# Altium schematic sheet Decoupling_caps.SchDoc
size 246 x 182 mm
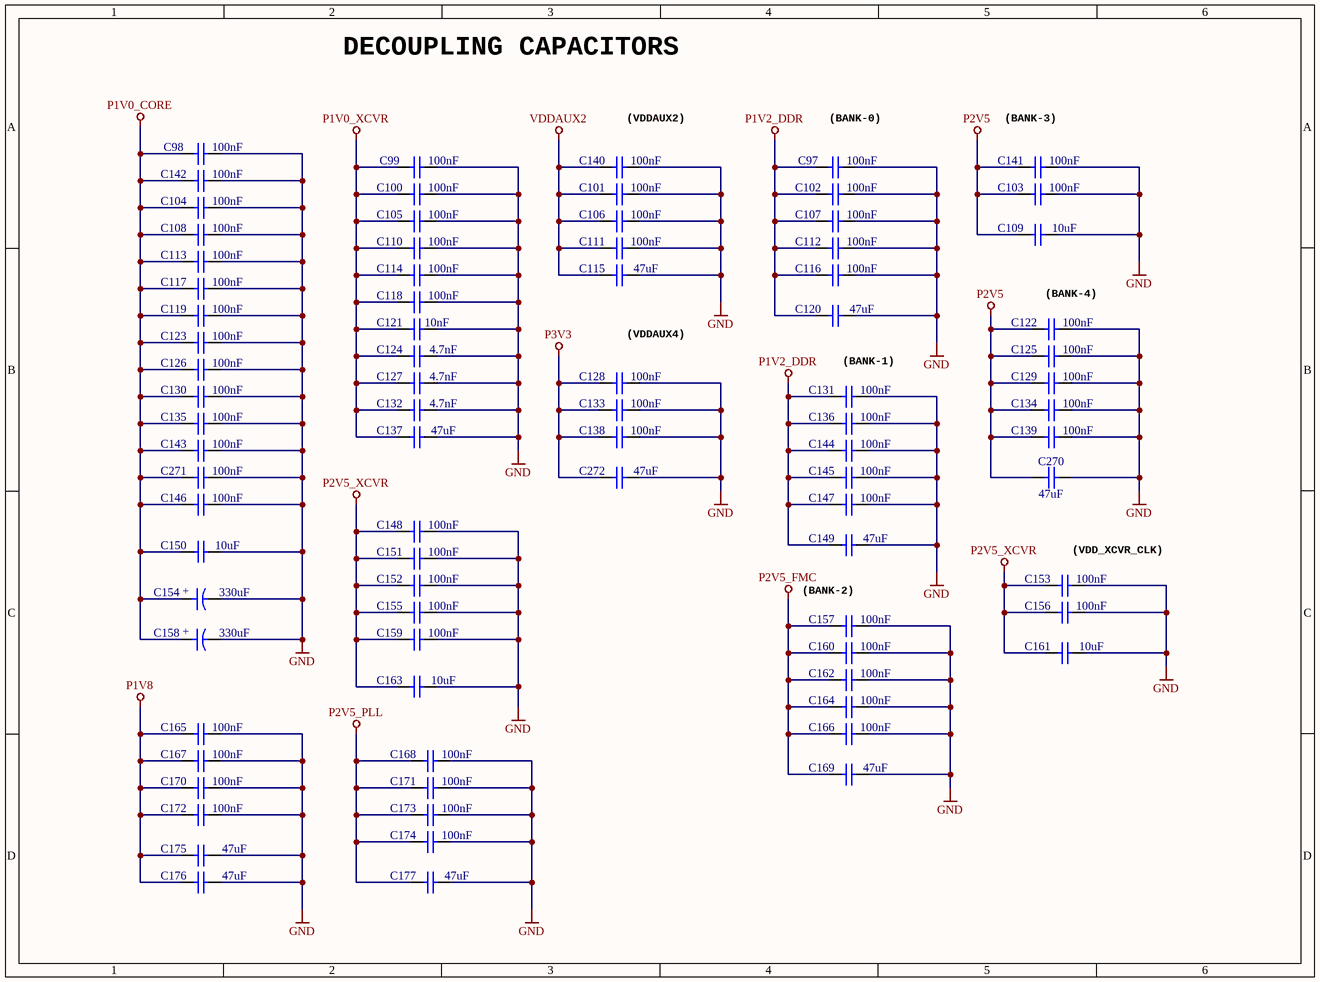
[diagram p0: Decoupling_caps.SchDoc]

## Parts
C97  100nF  [CAPC0603X33N]
C98  100nF  [CAPC0603X33N]
C99  100nF  [CAPC0603X33N]
C100  100nF  [CAPC0603X33N]
C101  100nF  [CAPC0603X33N]
C102  100nF  [CAPC0603X33N]
C103  100nF  [CAPC0603X33N]
C104  100nF  [CAPC0603X33N]
C105  100nF  [CAPC0603X33N]
C106  100nF  [CAPC0603X33N]
C107  100nF  [CAPC0603X33N]
C108  100nF  [CAPC0603X33N]
C109  10uF  [CAPC1608X80N]
C110  100nF  [CAPC0603X33N]
C111  100nF  [CAPC0603X33N]
C112  100nF  [CAPC0603X33N]
C113  100nF  [CAPC0603X33N]
C114  100nF  [CAPC0603X33N]
C115  47uF  [CAPC2012X140N]
C116  100nF  [CAPC0603X33N]
C117  100nF  [CAPC0603X33N]
C118  100nF  [CAPC0603X33N]
C119  100nF  [CAPC0603X33N]
C120  47uF  [CAPC2012X140N]
C121  10nF  [CAPC0603X33N]
C122  100nF  [CAPC0603X33N]
C123  100nF  [CAPC0603X33N]
C124  4.7nF  [CAPC0603X33N]
C125  100nF  [CAPC0603X33N]
C126  100nF  [CAPC0603X33N]
C127  4.7nF  [CAPC0603X33N]
C128  100nF  [CAPC0603X33N]
C129  100nF  [CAPC0603X33N]
C130  100nF  [CAPC0603X33N]
C131  100nF  [CAPC0603X33N]
C132  4.7nF  [CAPC0603X33N]
C133  100nF  [CAPC0603X33N]
C134  100nF  [CAPC0603X33N]
C135  100nF  [CAPC0603X33N]
C136  100nF  [CAPC0603X33N]
C137  47uF  [CAPC2012X140N]
C138  100nF  [CAPC0603X33N]
C139  100nF  [CAPC0603X33N]
C140  100nF  [CAPC0603X33N]
C141  100nF  [CAPC0603X33N]
C142  100nF  [CAPC0603X33N]
C143  100nF  [CAPC0603X33N]
C144  100nF  [CAPC0603X33N]
C145  100nF  [CAPC0603X33N]
C146  100nF  [CAPC0603X33N]
C147  100nF  [CAPC0603X33N]
C148  100nF  [CAPC0603X33N]
C149  47uF  [CAPC2012X140N]
C150  10uF  [CAPC1608X80N]
C151  100nF  [CAPC0603X33N]
C152  100nF  [CAPC0603X33N]
C153  100nF  [CAPC0603X33N]
C154  330uF  [CAPMP7343X310N]
C155  100nF  [CAPC0603X33N]
C156  100nF  [CAPC0603X33N]
C157  100nF  [CAPC0603X33N]
C158  330uF  [CAPMP7343X310N]
C159  100nF  [CAPC0603X33N]
C160  100nF  [CAPC0603X33N]
C161  10uF  [CAPC1608X80N]
C162  100nF  [CAPC0603X33N]
C163  10uF  [CAPC1608X80N]
C164  100nF  [CAPC0603X33N]
C165  100nF  [CAPC0603X33N]
C166  100nF  [CAPC0603X33N]
C167  100nF  [CAPC0603X33N]
C168  100nF  [CAPC0603X33N]
C169  47uF  [CAPC2012X140N]
C170  100nF  [CAPC0603X33N]
C171  100nF  [CAPC0603X33N]
C172  100nF  [CAPC0603X33N]
C173  100nF  [CAPC0603X33N]
C174  100nF  [CAPC0603X33N]
C175  47uF  [CAPC2012X140N]
C176  47uF  [CAPC2012X140N]
C177  47uF  [CAPC2012X140N]
C270  47uF  [CAPC2012X140N]
C271  100nF  [CAPC0603X33N]
C272  47uF  [CAPC2012X140N]

## Nets
GND: C97.2 C98.2 C99.2 C100.2 C101.2 C102.2 C103.2 C104.2 C105.2 C106.2 C107.2 C108.2 C109.2 C110.2 C111.2 C112.2 C113.2 C114.2 C115.2 C116.2 C117.2 C118.2 C119.2 C120.2 C121.2 C122.2 C123.2 C124.2 C125.2 C126.2 C127.2 C128.2 C129.2 C130.2 C131.2 C132.2 C133.2 C134.2 C135.2 C136.2 C137.2 C138.2 C139.2 C140.2 C141.2 C142.2 C143.2 C144.2 C145.2 C146.2 C147.2 C148.2 C149.2 C150.2 C151.2 C152.2 C153.2 C154.2 C155.2 C156.2 C157.2 C158.2 C159.2 C160.2 C161.2 C162.2 C163.2 C164.2 C165.2 C166.2 C167.2 C168.2 C169.2 C170.2 C171.2 C172.2 C173.2 C174.2 C175.2 C176.2 C177.2 C270.2 C271.2 C272.2
P1V0_CORE: C98.1 C104.1 C108.1 C113.1 C117.1 C119.1 C123.1 C126.1 C130.1 C135.1 C142.1 C143.1 C146.1 C150.1 C154.1 C158.1 C271.1
P1V0_XCVR: C99.1 C100.1 C105.1 C110.1 C114.1 C118.1 C121.1 C124.1 C127.1 C132.1 C137.1
P1V2_DDR: C97.1 C102.1 C107.1 C112.1 C116.1 C120.1 C131.1 C136.1 C144.1 C145.1 C147.1 C149.1
P1V8: C165.1 C167.1 C170.1 C172.1 C175.1 C176.1
P2V5: C103.1 C109.1 C122.1 C125.1 C129.1 C134.1 C139.1 C141.1 C270.1
P2V5_FMC: C157.1 C160.1 C162.1 C164.1 C166.1 C169.1
P2V5_PLL: C168.1 C171.1 C173.1 C174.1 C177.1
P2V5_XCVR: C148.1 C151.1 C152.1 C153.1 C155.1 C156.1 C159.1 C161.1 C163.1
P3V3: C128.1 C133.1 C138.1 C272.1
VDDAUX2: C101.1 C106.1 C111.1 C115.1 C140.1

## Notes on the sheet
- DECOUPLING CAPACITORS
- (near C140) (VDDAUX2)
- (near C97) (BANK-0)
- (near C141) (BANK-3)
- (near C122) (BANK-4)
- (VDDAUX4)
- (BANK-1)
- (BANK-2)
- (near C153) (VDD_XCVR_CLK)
- (in symbol CTE7343-31_330UF_6.3V_20%_LESR0025_KEMET_T520) +

## Library data of the parts
C97-C108 C110-C114 C116-C119 C122 C123 C125 C126 C128-C131 C133-C136 C138-C148 C151-C153 C155-C157 C159 C160 C162 C164-C168 C170-C174 C271 = CC0201_100NF_6.3V_10%_X5R: Non-polarised capacitor; Manufacturer: GENERIC; Part Description: SMD Multilayer Chip Ceramic Capacitor; Manufacturer1 Part Number: 02016D104KAT2A; Voltage: 6.3V; TC: X5R; Tolerance: ±10%; Part Number: CC0201_100NF_6.3V_10%_X5R; Component Kind: Standard; Component Type: Standard; Pin Count: 2; Value: 100nF; Status: Not Recommended; Manufacturer Part Number: CC0201_100NF_6.3V_10%_X5R; Case: 0201; Mounted: Yes; Socket: No; SMD: Yes; Sense: No; Manufacturer1 Example: AVX; Manufacturer1 ComponentHeight: 0.33mm; HelpURL: \\cern.ch\dfs\Applications\Altium\Datasheets\CC0201_X5R_AVX.pdf; Author: CERN DEM JLC; CreateDate: 03/12/2007; LatestRevisionDate: 03/12/2007
C109 C150 C161 C163 = CC0603_10UF_10V_10%_X5R: Non-polarised capacitor; Manufacturer: GENERIC; Part Description: SMD Multilayer Chip Ceramic Capacitor; Manufacturer1 Part Number: GRM188R61A106KE69D; Voltage: 10V; TC: X5R; Tolerance: ±10%; Part Number: CC0603_10UF_10V_10%_X5R; Component Kind: Standard; Component Type: Standard; Pin Count: 2; Value: 10uF; Status: None; Manufacturer Part Number: CC0603_10UF_10V_10%_X5R; Case: 0603; Mounted: Yes; Socket: No; SMD: Yes; Sense: No; Manufacturer1 Example: MURATA; Manufacturer1 ComponentHeight: 0.8mm; HelpURL: \\cern.ch\dfs\Applications\Altium\Datasheets\CC0603_MURATA_GRM188R61A106KE69D.pdf; Author: CERN DEM JLC; CreateDate: 31/01/2017; LatestRevisionDate: 31/01/2017
C115 C120 C137 C149 C169 C175-C177 C270 C272 = CC0805_47UF_6.3V_20%_X5R: Non-polarised capacitor; Manufacturer: GENERIC; Part Description: SMD Multilayer Chip Ceramic Capacitor; Manufacturer1 Part Number: C0805C476M9PACTU; Voltage: 6.3V; TC: X5R; Tolerance: ±20%; Part Number: CC0805_47UF_6.3V_20%_X5R; Component Kind: Standard; Component Type: Standard; Pin Count: 2; Value: 47uF; Status: Preferred; Manufacturer Part Number: CC0805_47UF_6.3V_20%_X5R; Case: 0805; Mounted: Yes; Socket: No; SMD: Yes; Sense: No; Manufacturer1 Example: KEMET; Manufacturer1 ComponentHeight: 1.4mm; HelpURL: \\cern.ch\dfs\Applications\Altium\Datasheets\CC0805_X5R_KEMET.pdf; Author: CERN DEM JLC; CreateDate: 16/10/2012; LatestRevisionDate: 16/10/2012
C121 = CC0201_10NF_10V_10%_X5R: Non-polarised capacitor; Manufacturer: GENERIC; Part Description: SMD Multilayer Chip Ceramic Capacitor; Manufacturer1 Part Number: 0201ZD103KAT2A; Voltage: 10V; TC: X5R; Tolerance: ±10%; Part Number: CC0201_10NF_10V_10%_X5R; Component Kind: Standard; Component Type: Standard; Pin Count: 2; Value: 10nF; Status: Not Recommended; Manufacturer Part Number: CC0201_10NF_10V_10%_X5R; Case: 0201; Mounted: Yes; Socket: No; SMD: Yes; Sense: No; Manufacturer1 Example: AVX; Manufacturer1 ComponentHeight: 0.33mm; HelpURL: \\cern.ch\dfs\Applications\Altium\Datasheets\CC0201_X5R_AVX.pdf; Author: CERN DEM JLC; CreateDate: 03/12/2007; LatestRevisionDate: 03/12/2007
C124 C127 C132 = CC0201_4.7NF_10V_10%_X5R: Non-polarised capacitor; Manufacturer: GENERIC; Part Description: SMD Multilayer Chip Ceramic Capacitor; Manufacturer1 Part Number: 0201ZD472KAT2A; Voltage: 10V; TC: X5R; Tolerance: ±10%; Part Number: CC0201_4.7NF_10V_10%_X5R; Component Kind: Standard; Component Type: Standard; Pin Count: 2; Value: 4.7nF; Status: Not Recommended; Manufacturer Part Number: CC0201_4.7NF_10V_10%_X5R; Case: 0201; Mounted: Yes; Socket: No; SMD: Yes; Sense: No; Manufacturer1 Example: AVX; Manufacturer1 ComponentHeight: 0.33mm; HelpURL: \\cern.ch\dfs\Applications\Altium\Datasheets\CC0201_X5R_AVX.pdf; Author: CERN DEM JLC; CreateDate: 03/12/2007; LatestRevisionDate: 03/12/2007
C154 C158 = CTE7343-31_330UF_6.3V_20%_LESR0025_KEMET_T520: Polarised capacitor; Manufacturer: KEMET; Part Description: Low ESR 0R025 Tantalum Chip Capacitor; Manufacturer Part Number: T520D337M006ATE025; Voltage: 6.3V; Tolerance: ±20%; Part Number: CTE7343-31_330UF_6.3V_20%_LESR0025_KEMET_T520; Component Kind: Standard; Component Type: Standard; Pin Count: 2; Value: 330uF; Status: None; Case: D; Mounted: Yes; Socket: No; SMD: Yes; Sense: No; ComponentHeight: 3.1mm; HelpURL: \\cern.ch\dfs\Applications\Altium\Datasheets\CTE-LESR_KEMET_T520.pdf; Author: CERN DEM JLC; CreateDate: 20/10/2010; LatestRevisionDate: 20/10/2010